# Altium project DigitalSpirometer.PrjPcb
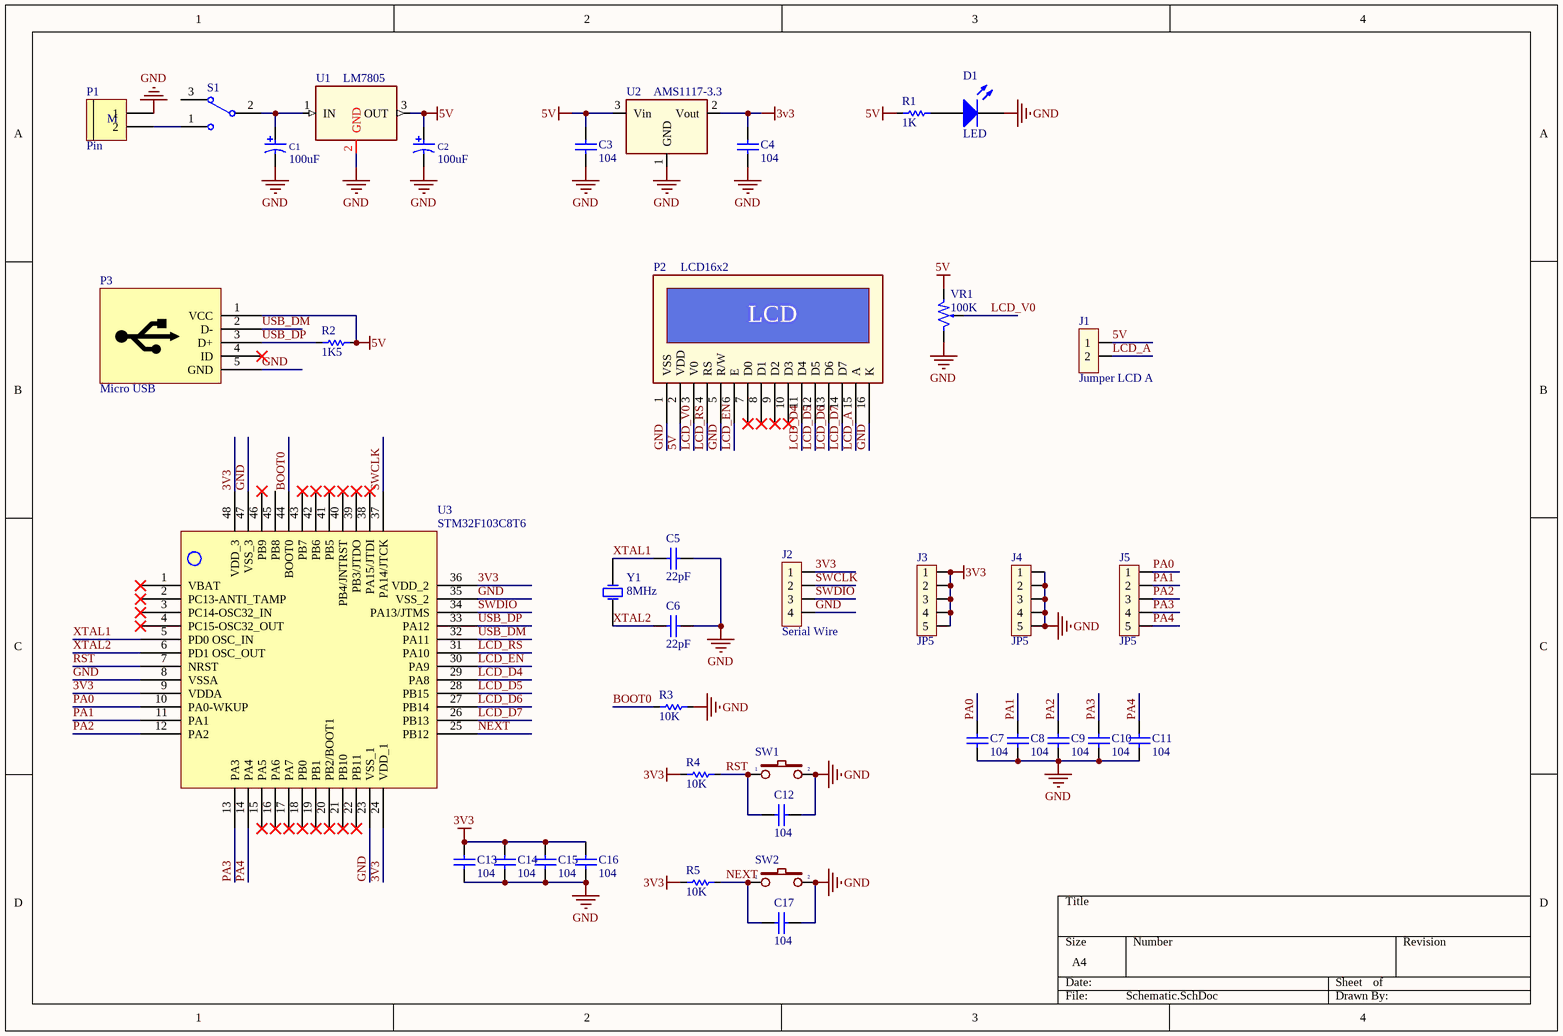
[diagram p0: Schematic.SchDoc]
1 sheet, 39 parts. Net scope: global (net labels, ports and power ports of the same name join across sheets).
Board file: PCB1.PcbDoc

## Sheet Schematic.SchDoc
size A4

### Parts
C1  100uF  [CAP_SMD_6_3MM]
C2  100uF  [CAP_SMD_6_3MM]
C3  value 104  [CAP_SMD_0805]  (hidden comment: Cap Non-pol)
C4  value 104  [CAP_SMD_0805]  (hidden comment: Cap Non-pol)
C5  value 22pF  [CAP_SMD_0805]  (hidden comment: Cap Non-pol)
C6  value 22pF  [CAP_SMD_0805]  (hidden comment: Cap Non-pol)
C7  value 104  [CAP_SMD_0805]  (hidden comment: Cap Non-pol)
C8  value 104  [CAP_SMD_0805]  (hidden comment: Cap Non-pol)
C9  value 104  [CAP_SMD_0805]  (hidden comment: Cap Non-pol)
C10  value 104  [CAP_SMD_0805]  (hidden comment: Cap Non-pol)
C11  value 104  [CAP_SMD_0805]  (hidden comment: Cap Non-pol)
C12  value 104  [CAP_SMD_0805]  (hidden comment: Cap Non-pol)
C13  value 104  [CAP_SMD_0805]  (hidden comment: Cap Non-pol)
C14  value 104  [CAP_SMD_0805]  (hidden comment: Cap Non-pol)
C15  value 104  [CAP_SMD_0805]  (hidden comment: Cap Non-pol)
C16  value 104  [CAP_SMD_0805]  (hidden comment: Cap Non-pol)
C17  value 104  [CAP_SMD_0805]  (hidden comment: Cap Non-pol)
D1  LED  [LED-0805 GREEN]
J1  Jumper LCD A  [CON.HDR1X2]
J2  Serial Wire  [CON.HDR1X4]
J3  JP5  [JP5]
J4  JP5  [JP5]
J5  JP5  [JP5]
P1  Pin  [Medium - Header 2]
P2  LCD16x2  [LCD16x2]
P3  Micro USB  [USB-MICRO]
R1  value 1K  [RES_SMD_0603]  (hidden comment: RESISTOR)
R2  value 1K5  [RES_SMD_0603]  (hidden comment: RESISTOR)
R3  value 10K  [RES_SMD_0603]  (hidden comment: RESISTOR)
R4  value 10K  [RES_SMD_0603]  (hidden comment: RESISTOR)
R5  value 10K  [RES_SMD_0603]  (hidden comment: RESISTOR)
S1  Switch SPDT  [SPDT]  (value not drawn)
SW1  SW  [SW2]  (value not drawn)
SW2  SW  [SW2]  (value not drawn)
U1  LM78xx  [TO-263]  (value not drawn)
U2  AMS1117-3.3  [SOT223]
U3  STM32F103C8T6  [TQFP48L]
VR1  100K  [VR]
Y1  8MHz  [XTAL]

### Nets
3V3: C4.2 C13.2 C14.2 C15.2 C16.2 J2.1 J3.1 J3.2 J3.3 J3.4 J3.5 R4.2 R5.2 U2.2(Vout) U3.9(VDDA) U3.24(VDD_1) U3.36(VDD_2) U3.48(VDD_3)
5V: C2.1 C3.2 J1.1 P2.2(VDD) P3.1(VCC) R1.2 R2.1 U1.3(OUT) U2.3(Vin) VR1.1
GND: C1.2 C2.2 C3.1 C4.1 C5.2 C6.2 C7.2 C8.2 C9.2 C10.2 C11.2 C12.2 C13.1 C14.1 C15.1 C16.1 C17.2 D1.2(K) J2.4 J4.1 J4.2 J4.3 J4.4 J4.5 P1.1 P2.1(VSS) P2.5(R/W) P2.16(K) P3.5(GND) R3.1 SW1.2 SW2.2 U1.2(GND) U2.1(GND) U3.8(VSSA) U3.23(VSS_1) U3.35(VSS_2) U3.47(VSS_3) VR1.3
BOOT0: R3.2 U3.44(BOOT0)
LCD_A: J1.2 P2.15(A)
LCD_D4: P2.11(D4) U3.29(PA8)
LCD_D5: P2.12(D5) U3.28(PB15)
LCD_D6: P2.13(D6) U3.27(PB14)
LCD_D7: P2.14(D7) U3.26(PB13)
LCD_EN: P2.6(E) U3.30(PA9)
LCD_RS: P2.4(RS) U3.31(PA10)
LCD_V0: P2.3(V0) VR1.2
NEXT: C17.1 R5.1 SW2.1 U3.25(PB12)
PA0: C7.1 J5.1 U3.10(PA0-WKUP)
PA1: C8.1 J5.2 U3.11(PA1)
PA2: C9.1 J5.3 U3.12(PA2)
PA3: C10.1 J5.4 U3.13(PA3)
PA4: C11.1 J5.5 U3.14(PA4)
RST: C12.1 R4.1 SW1.1 U3.7(NRST)
SWCLK: J2.2 U3.37(PA14/JTCK)
SWDIO: J2.3 U3.34(PA13/JTMS)
USB_DM: P3.2(D-) U3.32(PA11)
USB_DP: P3.3(D+) R2.2 U3.33(PA12)
XTAL1: C5.1 U3.5(PD0_OSC_IN) Y1.2(OSC2)
XTAL2: C6.1 U3.6(PD1_OSC_OUT) Y1.1(OSC1)
NetC1_1: C1.1 S1.2 U1.1(IN)
NetD1_1: D1.1(A) R1.1
NetP1_2: P1.2 S1.1

Not connected (* = marked no-connect by the designer): P2 7(D0)* 8(D1)* 9(D2)* 10(D3)*; P3 4(ID)*; S1 3; U3 1(VBAT)* 2(PC13-ANTI_TAMP)* 3(PC14-OSC32_IN)* 4(PC15-OSC32_OUT)* 15(PA5)* 16(PA6)* 17(PA7)* 18(PB0)* 19(PB1)* 20(PB2/BOOT1)* 21(PB10)* 22(PB11)* 38(PA15/JTDI)* 39(PB3/JTDO)* 40(PB4/JNTRST)* 41(PB5)* 42(PB6)* 43(PB7)* 45(PB8) 46(PB9)*

### Notes on the sheet
- (near U1) LM7805
- (in symbol Header 2 - M) M
- (in symbol LCD Text) LCD

### Library data of the parts
C1 C2 = Cap_Pol: Polarized Capacitor; Manufacturer: FARNELL; AEMS Code: 2100110; Vendor: Digikey; Capacitor Type: Tant; Volt: 25V; Published: 13-April-2009; Publisher: Hoang Nguyen; ComponentLink1Description: Digikey Part Link; ComponentLink2Description: Open Datasheet; ComponentLink2URL: H:\LIBRARY\LIBRARY.Datasheet\; Value: 100uF
C3-C17 = Cap Non-pol: Non-polarized Capacitor; LatestRevisionNote: Re-released for DXP Platform.; PackageReference: RAD-0.3; Publisher: Altium Limited
D1 = LED: Typical LED; Published: 8-Jun-2000; LatestRevisionDate: 08-Jul-2005; LatestRevisionNote: Mech Layer 1 removed.; PackageReference: LED-1; Publisher: Altium Limited
J1 = JP2: Jumper 3; Value: J3
J2 = JP4
P1 = Header 2 - M: Header, 2-Pin, Medium; LatestRevisionDate: 17-Jul-2002; LatestRevisionNote: Re-released for DXP Platform.; Publisher: Altium Limited
P2 = LCD Text
P3 = USB_M
S1 = Switch SPDT: Single-Pole, Double-Throw Switch; Published: 24-Mar-1999; LatestRevisionDate: 17-Dec-2003; LatestRevisionNote: Schematic revised, PCB Footprint replaced.; DatasheetDocument: 05-Dec-2000; PackageReference: TL36WW15050; Publisher: Altium Limited; ComponentLink1Description: Manufacturer Link; ComponentLink1URL: http://www.apem.com
SW1 SW2 = SW2: Switch button 2 pin; Value: SW chip 2 pin
U1 = 78xx: Regulator; Manufacturer: Fairchild Semiconductor Corporation; PSpiceTemplate: X^@REFDES %IN %OUT %GND @MODEL; Vendor: Digikey; Output Current: Up to 1A; V out: 5V; Tolerance: 4 %; Value: LM7805CT; Published: 13-April-2009; Publisher: Hoang Nguyen; ComponentLink1Description: Digikey Part Link; ComponentLink2Description: Open Datasheet; ComponentLink2URL: H:\LIBRARY\LIBRARY.Datasheet\LM7805.pdf; Price: 2500 VND
U2 = AMS1117: Regulator SMD Chip; Designed By: John MacTavish; Vendor: Digikey; ComponentLink1Description: Digikey Part Link; ComponentLink2Description: Open Datasheet; ComponentLink2URL: H:\LIBRARY\LIBRARY.Datasheet\
U3 = STM32F103C8T6-LQFP48: Published: 30-May-2008; DatasheetVersion: rev6, Mar-2008; PackageVersion: Mar-2008; PackageReference: LQFP48; Publisher: Altium Limited; PackageDescription: 48-Pin Low-Profile Quad Flat Pack, 7 x 7 mm Body, 0.5 mm Pitch (LQFP48); ComponentLink1Description: Manufacturer Link; ComponentLink1URL: www.st.com/stm32; ComponentLink2Description: Datasheet; ComponentLink2URL: http://www.st.com/stonline/products/literature/ds/13586.pdf
VR1 = VR1: Var Resistor; Value: VR 10K
Y1 = XTAL: Crystal Oscillator; Published: 8-Jun-2000; LatestRevisionDate: 17-Jul-2002; LatestRevisionNote: Re-released for DXP Platform.; PackageReference: R38; Publisher: Altium Limited
R1-R5 = RESISTOR: Published: 8-Jun-2000; LatestRevisionDate: 17-Jul-2002; LatestRevisionNote: Re-released for DXP Platform.; PackageReference: AXIAL-0.3; Publisher: Altium Limited